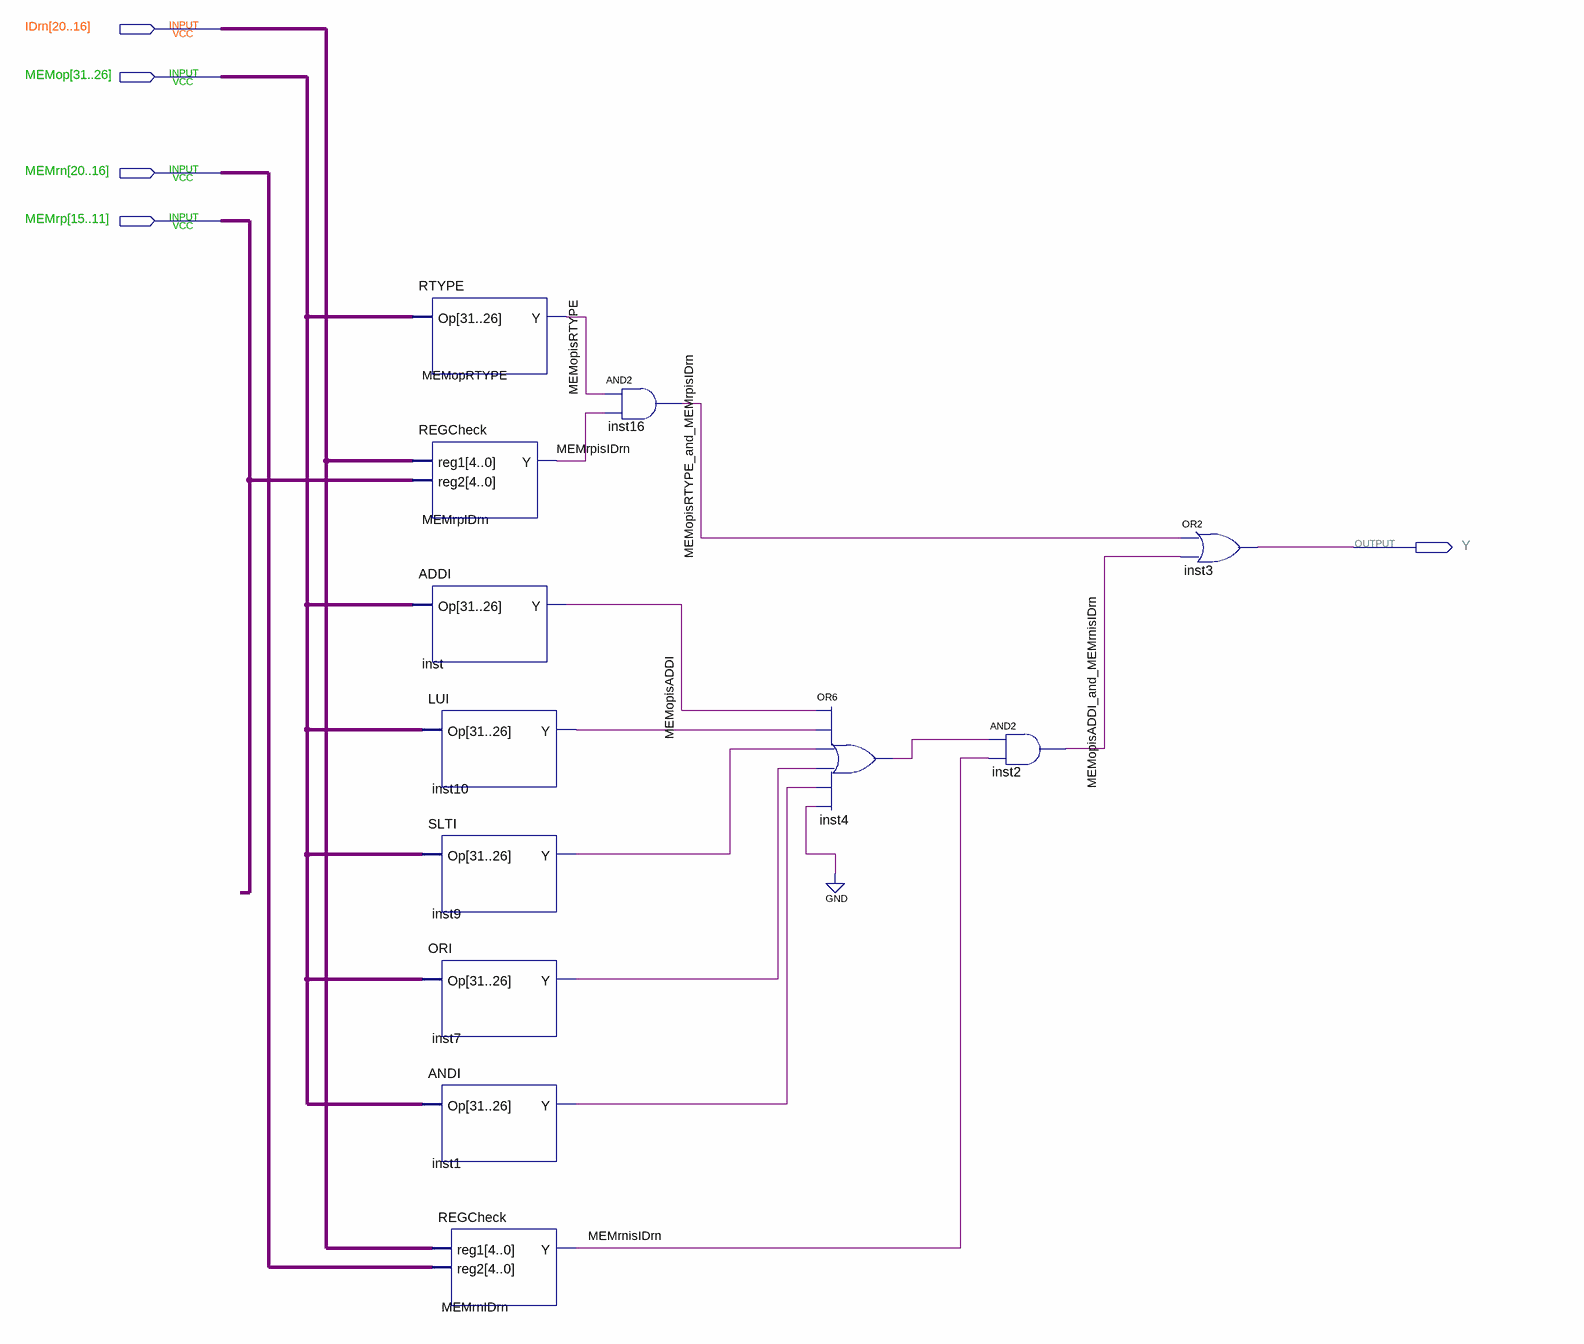
[diagram p0: schematic sheet]
// Quartus schematic ForwardBfromMEMtoID.bdf as structural Verilog: 12 symbols, 5 pins
module ForwardBfromMEMtoID (
  input  [20:16] IDrn,
  input  [31:26] MEMop,
  input  [20:16] MEMrn,
  input  [15:11] MEMrp,
  output Y
);

  wire inst1_y, inst4_out, inst7_y, inst9_y, inst10_y, MEMopisADDI, MEMopisADDI_and_MEMrnisIDrn,
       MEMopisRTYPE, MEMopisRTYPE_and_MEMrpisIDrn, MEMrnisIDrn, MEMrpisIDrn;

  RTYPE MEMopRTYPE (.Op(MEMop), .Y(MEMopisRTYPE));
  REGCheck MEMrpIDrn (.reg1(IDrn), .reg2(MEMrp), .Y(MEMrpisIDrn));
  ADDI inst (.Op(MEMop), .Y(MEMopisADDI));
  LUI inst10 (.Op(MEMop), .Y(inst10_y));
  SLTI inst9 (.Op(MEMop), .Y(inst9_y));
  ORI inst7 (.Op(MEMop), .Y(inst7_y));
  ANDI inst1 (.Op(MEMop), .Y(inst1_y));
  REGCheck MEMrnIDrn (.reg1(IDrn), .reg2(MEMrn), .Y(MEMrnisIDrn));
  and inst16 (MEMopisRTYPE_and_MEMrpisIDrn, MEMopisRTYPE, MEMrpisIDrn);
  or inst4 (inst4_out, MEMopisADDI, inst10_y, inst9_y, inst7_y, inst1_y, 1'b0);
  and inst2 (MEMopisADDI_and_MEMrnisIDrn, inst4_out, MEMrnisIDrn);
  or inst3 (Y, MEMopisRTYPE_and_MEMrpisIDrn, MEMopisADDI_and_MEMrnisIDrn);
endmodule
